# EAGLE design multidip_v1.1 (EAGLE 7.5.0)
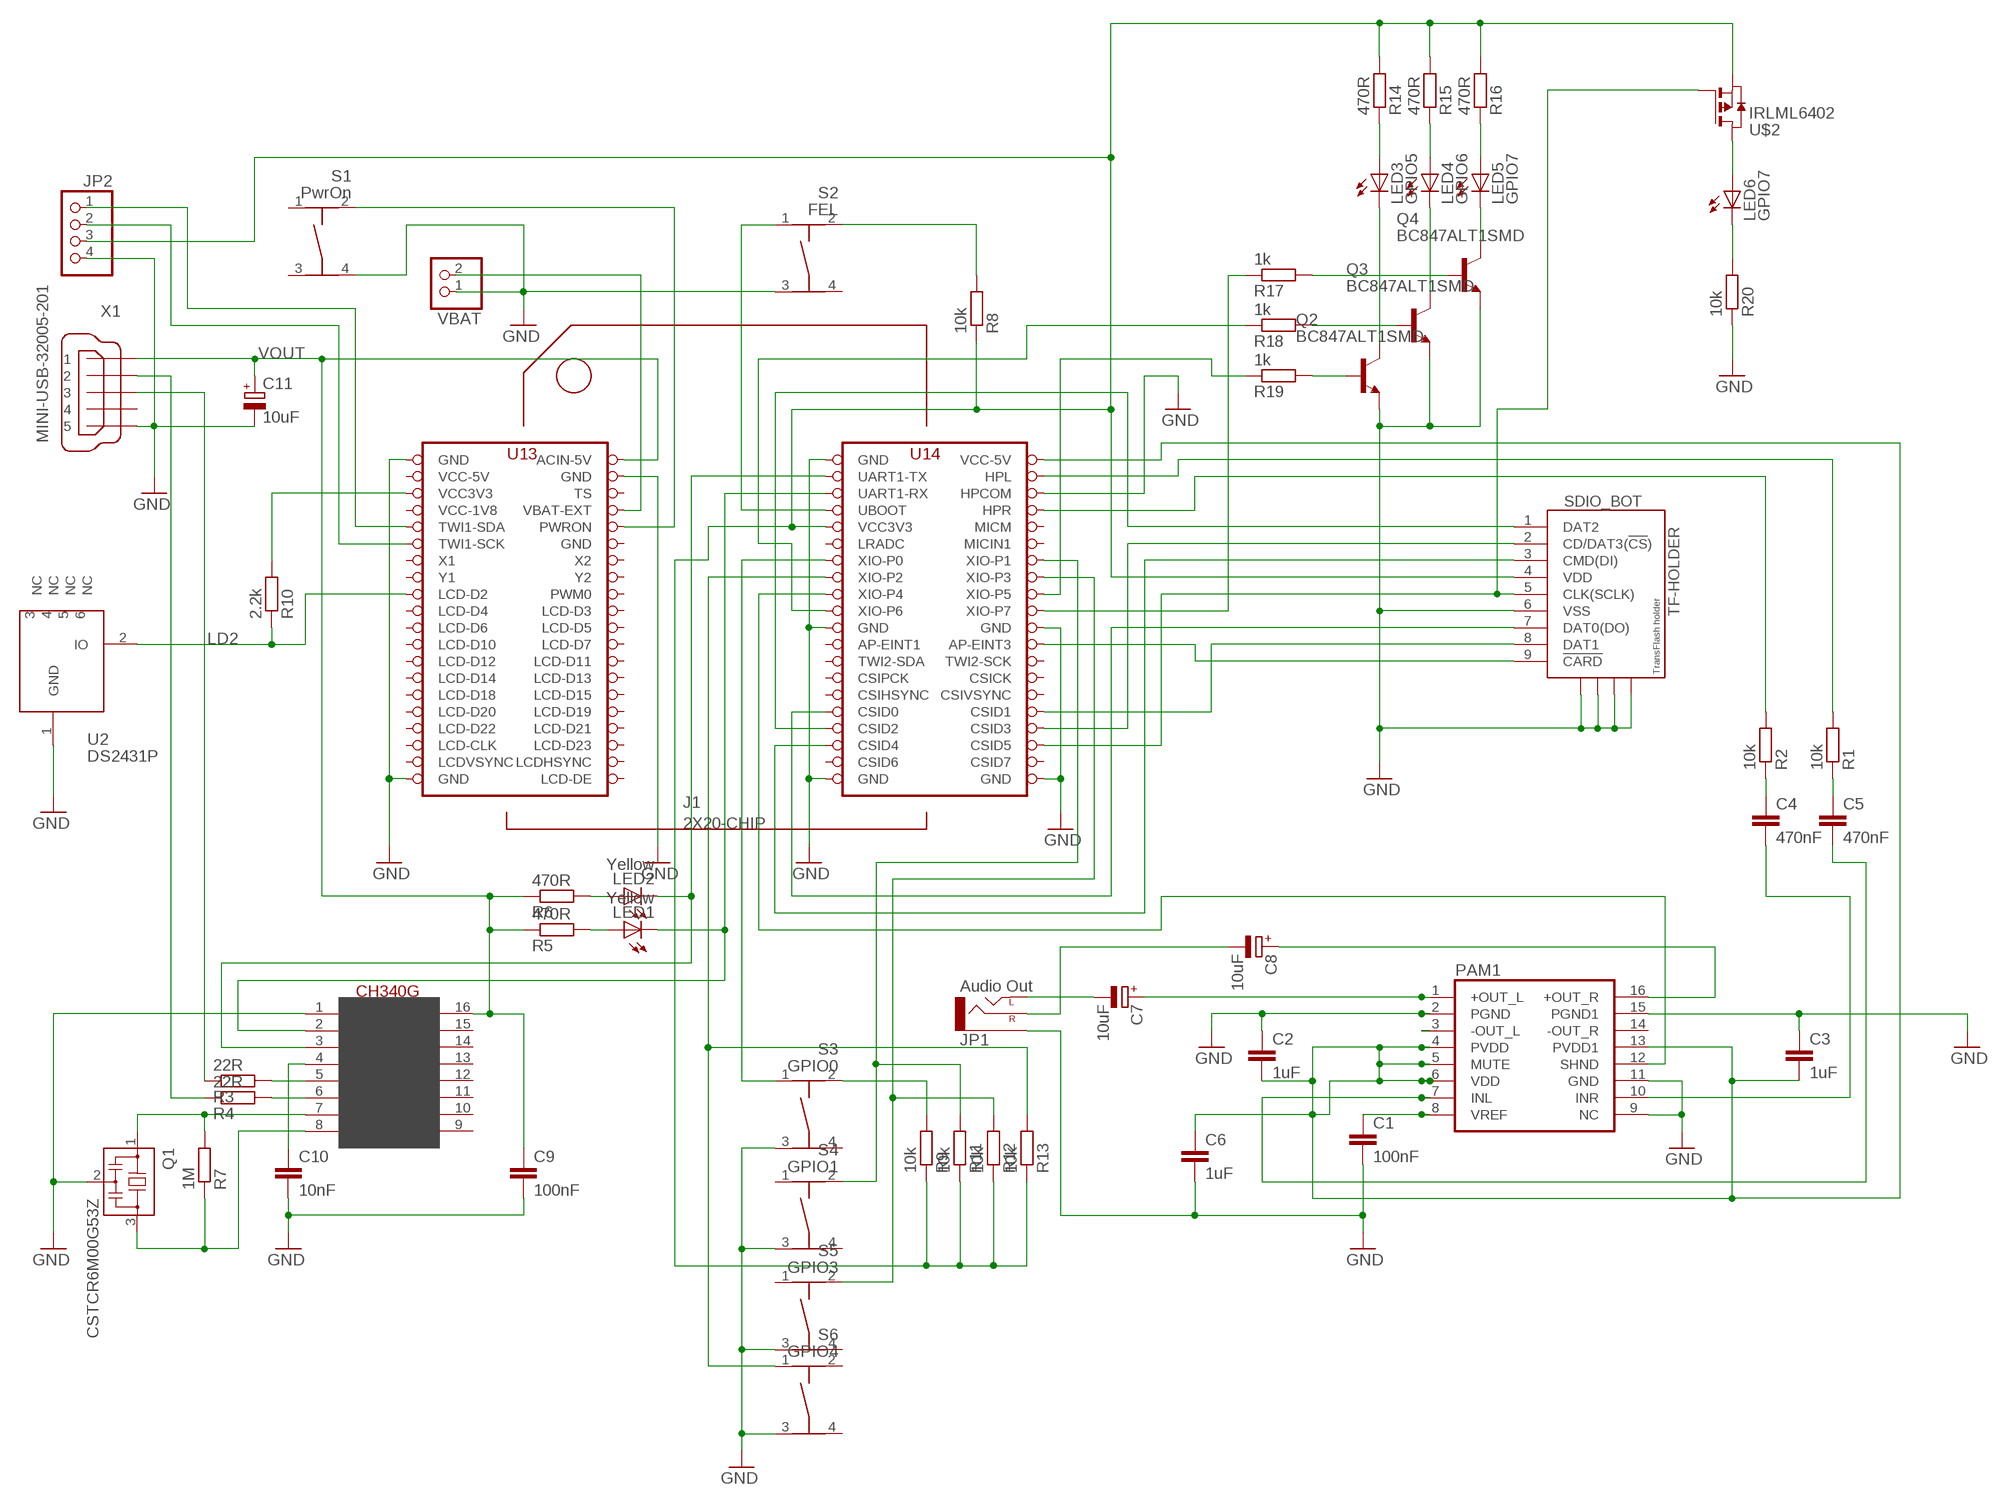
[diagram p0: schematic, sheet 1]

## Parts
C1  100nF  C-EUC0805  [C0805]
C2  1uF  C-EUC0805  [C0805]
C3  1uF  C-EUC0805  [C0805]
C4  470nF  C-EUC0805  [C0805]
C5  470nF  C-EUC0805  [C0805]
C6  1uF  C-EUC0805  [C0805]
C7  10uF  CPOL-EUCT3216  [CT3216]
C8  10uF  CPOL-EUCT3216  [CT3216]
C9  100nF  C-EUC0805  [C0805]
C10  10nF  C-EUC0805  [C0805]
C11  10uF  CPOL-EUCT3216  [CT3216]
J1  2X20-CHIP  [2X20CHIP_OFFSET-TH]
JP1  Audio Out  AUDIO-JACKPTH  [AUDIO-JACK]
JP2  PINHD-1X4  [1X04]
LED1  Yellow  LEDCHIP-LED0805  [CHIP-LED0805]
LED2  Yellow  LEDCHIP-LED0805  [CHIP-LED0805]
LED3  GPIO5  LEDCHIP-LED0805  [CHIP-LED0805]
LED4  GPIO6  LEDCHIP-LED0805  [CHIP-LED0805]
LED5  GPIO7  LEDCHIP-LED0805  [CHIP-LED0805]
LED6  GPIO7  LEDCHIP-LED0805  [CHIP-LED0805]
PAM1  PAM8403  [SOP-16]
Q1  CSTCR6M00G53Z  [CSTCR6M]
Q2  BC847ALT1SMD  [SOT23]
Q3  BC847ALT1SMD  [SOT23]
Q4  BC847ALT1SMD  [SOT23]
R1  10k  R-EU_MELF0204W  [MINI_MELF-0204W]
R2  10k  R-EU_MELF0204W  [MINI_MELF-0204W]
R3  22R  R-EU_MELF0204W  [MINI_MELF-0204W]
R4  22R  R-EU_MELF0204W  [MINI_MELF-0204W]
R5  470R  R-EU_MELF0204W  [MINI_MELF-0204W]
R6  470R  R-EU_MELF0204W  [MINI_MELF-0204W]
R7  1M  R-EU_MELF0204W  [MINI_MELF-0204W]
R8  10k  R-EU_MELF0204W  [MINI_MELF-0204W]
R9  10k  R-EU_MELF0204W  [MINI_MELF-0204W]
R10  2.2k  R-EU_MELF0204W  [MINI_MELF-0204W]
R11  10k  R-EU_MELF0204W  [MINI_MELF-0204W]
R12  10k  R-EU_MELF0204W  [MINI_MELF-0204W]
R13  10k  R-EU_MELF0204W  [MINI_MELF-0204W]
R14  470R  R-EU_MELF0204W  [MINI_MELF-0204W]
R15  470R  R-EU_MELF0204W  [MINI_MELF-0204W]
R16  470R  R-EU_MELF0204W  [MINI_MELF-0204W]
R17  1k  R-EU_MELF0204W  [MINI_MELF-0204W]
R18  1k  R-EU_MELF0204W  [MINI_MELF-0204W]
R19  1k  R-EU_MELF0204W  [MINI_MELF-0204W]
R20  10k  R-EU_MELF0204W  [MINI_MELF-0204W]
S1  PwrOn  TASTER-9314_SMD  [TASTER-9314_SMD]
S2  FEL  TASTER-9314_SMD  [TASTER-9314_SMD]
S3  GPIO0  TASTER-9314_SMD  [TASTER-9314_SMD]
S4  GPIO1  TASTER-9314_SMD  [TASTER-9314_SMD]
S5  GPIO3  TASTER-9314_SMD  [TASTER-9314_SMD]
S6  GPIO4  TASTER-9314_SMD  [TASTER-9314_SMD]
SDIO_BOT  TF-HOLDER  [TF-PULL]
U2  DS2431P  [TSOC6]
U$1  CH340G  [SOIC16]
U$2  IRLML6402  [SOT-23]
VBAT  PINHD-1X2  [1X02]
X1  MINI-USB-32005-201  [32005-201]

## Nets
GND: C1.2 C2.1 C3.1 C6.2 C9.2 C10.2 C11.- J1.GND@1(GND) J1.GND@2(GND) J1.GND@4(GND) J1.GND@5(GND) J1.GND@6(GND) J1.GND@7(GND) J1.GND@8(GND) J1.GND@10(GND) J1.HPCOM JP1.SLEEVE JP2.4 PAM1.2(PGND) PAM1.9(NC) PAM1.11(GND) PAM1.15(PGND1) Q1.2 Q2.2(E) Q3.2(E) Q4.2(E) R20.1 S1.4 S2.3 S3.3 S4.3 S5.3 S6.3 SDIO_BOT.6(VSS) SDIO_BOT.S1 SDIO_BOT.S2 SDIO_BOT.S3 SDIO_BOT.S4 U2.1(GND) U$1.1(GND) VBAT.1 X1.5
LD2: J1.LCD-D2 R10.1 U2.2(IO)
N$1: J1.VCC3V3 R10.2
N$2: J1.CSID3 SDIO_BOT.2(CD/DAT3(!CS!))
N$3: J1.CSID0 SDIO_BOT.7(DAT0(DO))
N$4: J1.CSID4 SDIO_BOT.3(CMD(DI))
N$5: J1.CSID5 SDIO_BOT.5(CLK(SCLK)) U$2.1(G)
N$6: J1.CSID1 SDIO_BOT.8(DAT1)
N$7: C2.2 C3.2 C6.1 J1.VCC5V@1(VCC-5V) PAM1.4(PVDD) PAM1.5(MUTE) PAM1.6(VDD) PAM1.13(PVDD1)
N$8: LED3.C Q2.3(C)
N$9: J1.CSID2 SDIO_BOT.1(DAT2)
N$10: LED4.C Q3.3(C)
N$11: C7.+ PAM1.1(+OUT_L)
N$12: C7.- JP1.TIP(LEFT)
N$13: C8.+ PAM1.16(+OUT_R)
N$14: C8.- JP1.RING(RIGHT)
N$15: R3.1 X1.3
N$16: J1.AP-EINT3 SDIO_BOT.9(!CARD)
N$17: PAM1.3(-OUT_L)
N$18: Q4.1(B) R17.2
N$19: J1.HPL R1.2
N$20: C1.1 PAM1.8(VREF)
N$21: C4.1 R2.1
N$22: C5.1 R1.1
N$23: J1.XIO-P1 R11.2 S4.2
N$24: J1.XIO-P3 R12.2 S5.2
N$25: J1.XIO-P0 S3.1
N$26: J1.XIO-P2 R13.2 S6.1
N$27: J1.XIO-P4 PAM1.12(SHND)
N$28: J1.BAT(VBAT-EXT) VBAT.2
N$29: J1.PWRON S1.2
N$30: J1.HPR R2.2
N$31: C4.2 PAM1.10(INR)
N$32: C5.2 PAM1.7(INL)
N$33: R3.2 U$1.5(D+)
N$34: R4.2 U$1.6(D-)
N$35: Q1.1 R7.2 U$1.7(XI)
N$36: Q1.3 R7.1 U$1.8(XO)
N$37: C10.1 U$1.4(V3)
N$38: J1.UART1-TX LED2.C U$1.3(RX)
N$39: J1.UART1-RX LED1.C U$1.2(TX)
N$40: LED2.A R6.2
N$41: LED1.A R5.2
N$42: J1.FEL(UBOOT) S2.1
N$43: R8.2 S2.2
N$44: LED5.C Q4.3(C)
N$45: R9.2 S3.2
N$46: J1.VCC3V3@1(VCC3V3) JP2.3 R8.1 R9.1 R11.1 R12.1 R13.1 R14.2 R15.2 R16.2 SDIO_BOT.4(VDD) U$2.2(S)
N$47: LED3.A R14.1
N$48: LED4.A R15.1
N$49: LED5.A R16.1
N$50: J1.XIO-P5 R19.1
N$51: J1.XIO-P6 R18.1
N$52: J1.XIO-P7 R17.1
N$53: R4.1 X1.2
N$54: J1.TWI1-SCK JP2.2
N$55: J1.TWI1-SDA JP2.1
N$56: Q3.1(B) R18.2
N$57: Q2.1(B) R19.2
N$58: LED6.A U$2.3(D)
N$59: LED6.C R20.2
VOUT: C9.1 C11.+ J1.CHG-IN(ACIN-5V) R5.1 R6.1 U$1.16(VCC) X1.1
Unconnected: J1.AP-EINT1 J1.CSICK J1.CSID6 J1.CSID7 J1.CSIHSYNC J1.CSIPCK J1.CSIVSYNC J1.LCD-CLK J1.LCD-D3 J1.LCD-D4 J1.LCD-D5 J1.LCD-D6 J1.LCD-D7 J1.LCD-D10 J1.LCD-D11 J1.LCD-D12 J1.LCD-D13 J1.LCD-D14 J1.LCD-D15 J1.LCD-D18 J1.LCD-D19 J1.LCD-D20 J1.LCD-D21 J1.LCD-D22 J1.LCD-D23 J1.LCD-DE J1.LCD-HSYNC(LCDHSYNC) J1.LCD-VSYNC(LCDVSYNC) J1.LRADC J1.MICIN1 J1.MICM J1.PWM0 J1.TS J1.TWI2-SCK J1.TWI2-SDA J1.X1 J1.X2 J1.Y1 J1.Y2 PAM1.14(-OUT_R) S1.1 S1.3 S2.4 S3.4 S4.1 S4.4 S5.1 S5.4 S6.2 S6.4 U2.3(NC) U2.4(NC) U2.5(NC) U2.6(NC) U$1.9(CTS) U$1.10(DSR) U$1.11(RI) U$1.12(DCD) U$1.13(DTR) U$1.14(RTS) U$1.15(RS232) X1.4

## Power pins joined to a net without a drawn wire
GND: J1.GND@3(GND)
VCC-1V8: J1.VCC1V8(VCC-1V8)
VCC-5V: J1.VCC5V@0(VCC-5V)

## Library data of the parts
C1-C6 C9 C10 = rcl:C-EU: CAPACITOR, European symbol
C7 C8 C11 = rcl:CPOL-EU: POLARIZED CAPACITOR, European symbol
J1 = JKW_CHIP:2X20-CHIP: Through hole layout with chip reference
JP1 = SparkFun-Connectors:AUDIO-JACK: 3.5mm Audio Jack Simple 3.5mm common PCB mount audio jack. Variant PTH is our storefront SKU PRT-08032
JP2 = pinhead:PINHD-1X4: PIN HEADER
LED1-LED6 = led:LED: LED OSRAM: - CHIPLED LG R971, LG N971, LY N971, LG Q971, LY Q971, LO R971, LY R971 LH N974, LH R974 LS Q976, LO Q976, LY Q976 LO Q996 - Hyper CHIPLED LW Q18S LB Q993, LB Q99A, LB R99A - SideLED LS A670, LO A670, LY A670, LG A670, LP A670 LB A673, LV A673, LT A673, LW A673 LH A674 LY A675 LS A676, LA A676, LO A676, LY A676, LW A676 LS A679, LY A679, LG A679 - Hyper Micro SIDELED® LS Y876, LA Y876, LO Y876, LY Y876 LT Y87S - SmartLED LW L88C, LW L88S LB L89C, LB L89S, LG L890 LS L89K, LO L89K, LY L89K LS L896, LA L896, LO L896, LY L896 - TOPLED LS T670, LO T670, LY T670, LG T670, LP T670 LSG T670, LSP T670, LSY T670, LOP T670, LYG T670 LG T671, LOG T671, LSG T671 LB T673, LV T673, LT T673, LW T673 LH T674 LS T676, LA T676, LO T676, LY T676, LB T676, LH T676, LSB T676, LW T676 LB T67C, LV T67C, LT T67C, LS T67K, LO T67K, LY T67K, LW E67C LS E67B, LA E67B, LO E67B, LY E67B, LB E67C, LV E67C, LT E67C LW T67C LS T679, LY T679, LG T679 LS T770, LO T770, LY T770, LG T770, LP T770 LB T773, LV T773, LT T773, LW T773 LH T774 LS E675, LA E675, LY E675, LS T675 LS T776, LA T776, LO T776, LY T776, LB T776 LHGB T686 LT T68C, LB T68C - Hyper Mini TOPLED® LB M676 - Mini TOPLED Santana® LG M470 LS M47K, LO M47K, LY M47K Source: http://www.osram.convergy.de LUXEON: - LUMILED® LXK2-PW12-R00, LXK2-PW12-S00, LXK2-PW14-U00, LXK2-PW14-V00 LXK2-PM12-R00, LXK2-PM12-S00, LXK2-PM14-U00 LXK2-PE12-Q00, LXK2-PE12-R00, LXK2-PE12-S00, LXK2-PE14-T00, LXK2-PE14-U00 LXK2-PB12-K00, LXK2-PB12-L00, LXK2-PB12-M00, LXK2-PB14-N00, LXK2-PB14-P00, LXK2-PB14-Q00 LXK2-PR12-L00, LXK2-PR12-M00, LXK2-PR14-Q00, LXK2-PR14-R00 LXK2-PD12-Q00, LXK2-PD12-R00, LXK2-PD12-S00 LXK2-PH12-R00, LXK2-PH12-S00 LXK2-PL12-P00, LXK2-PL12-Q00, LXK2-PL12-R00 Source: www.luxeon.com KINGBRIGHT: KA-3528ASYC Source: www.kingbright.com
PAM1 = JKW_CHIP:PAM8403: Dual channel audio amplifier IC - PAM8403
Q1 = murata-filter:CSTCR: Resonator Source: murata.co.jp; MPN: CSTCR6M00G53-R0; OC_FARNELL: 1170434; OC_NEWARK: 25M8759
Q2-Q4 = transistor-npn:BC847*: NPN Transistor
R1-R20 = rcl:R-EU_: RESISTOR, European symbol
S1-S6 = Ergaenzung:TASTER-9314_SMD
SDIO_BOT = JKW_CHIP:TF-HOLDER: TF / Micro SD socket is PUSH-PUSH type, the card can be pushed into and auto locked and pushed out by simply press the card. Surface Mounting type.
U2 = JKW_CHIP:DS2431: 1024-Bit EEPROM This chip provides a 4x256 Bit EEPROM, which can be programmed@5V. Write protection and OTP emulation are available, too. Author: Jan Kandziora <jjj@gmx.de>; DESCRIPTION: IC, 1024-Bit, 1-Wire EEPROM, TSOC6; FOOTPRINT: TSOC6; LINK: http://www.digikey.com/product-detail/en/DS2431P%2BT%26R/DS2431P%2BT%26RCT-ND/3647900; MFG: DIGIKEY; MFG_PN: DS2431P+T&RCT-ND; PART_TYPE: IC; PRICE: 0.98; VENDOR: MAXIM; VENDOR_PART_NUMBER: DS2431P+T&R
U$1 = usb-serial:CH340G
U$2 = IRLML6402:IRLML6402
VBAT = pinhead:PINHD-1X2: PIN HEADER
X1 = con-cypressindustries:MINI-USB-: MINI USB-B Conector Source: www.cypressindustries.com; OC_FARNELL: unknown; OC_NEWARK: unknown

## Board
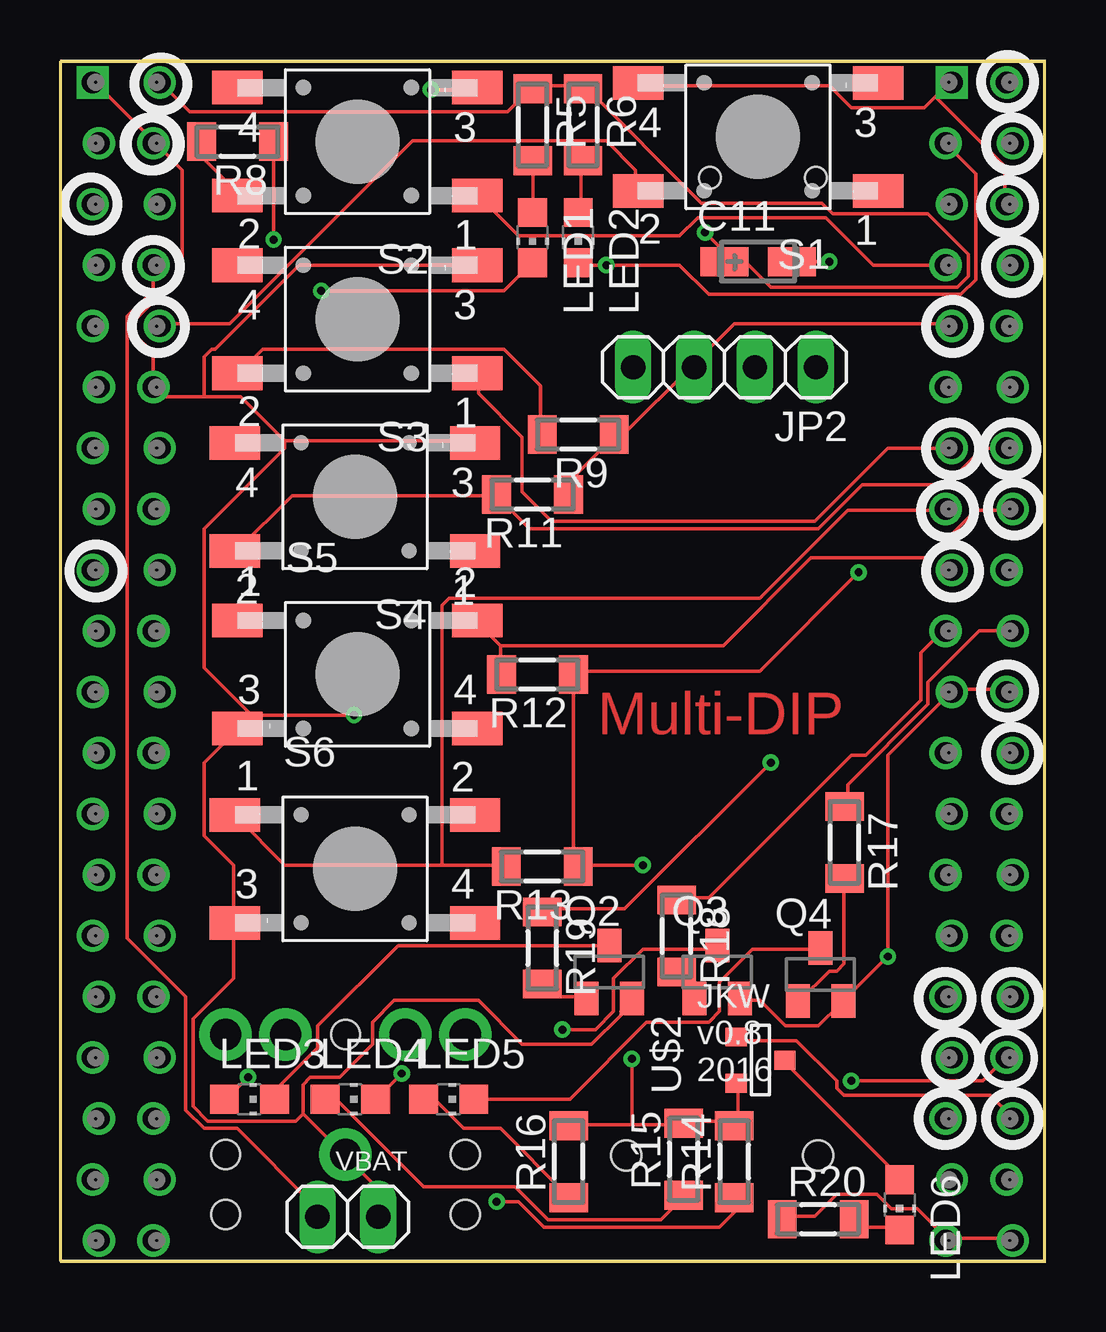
[diagram p1: board, top side]
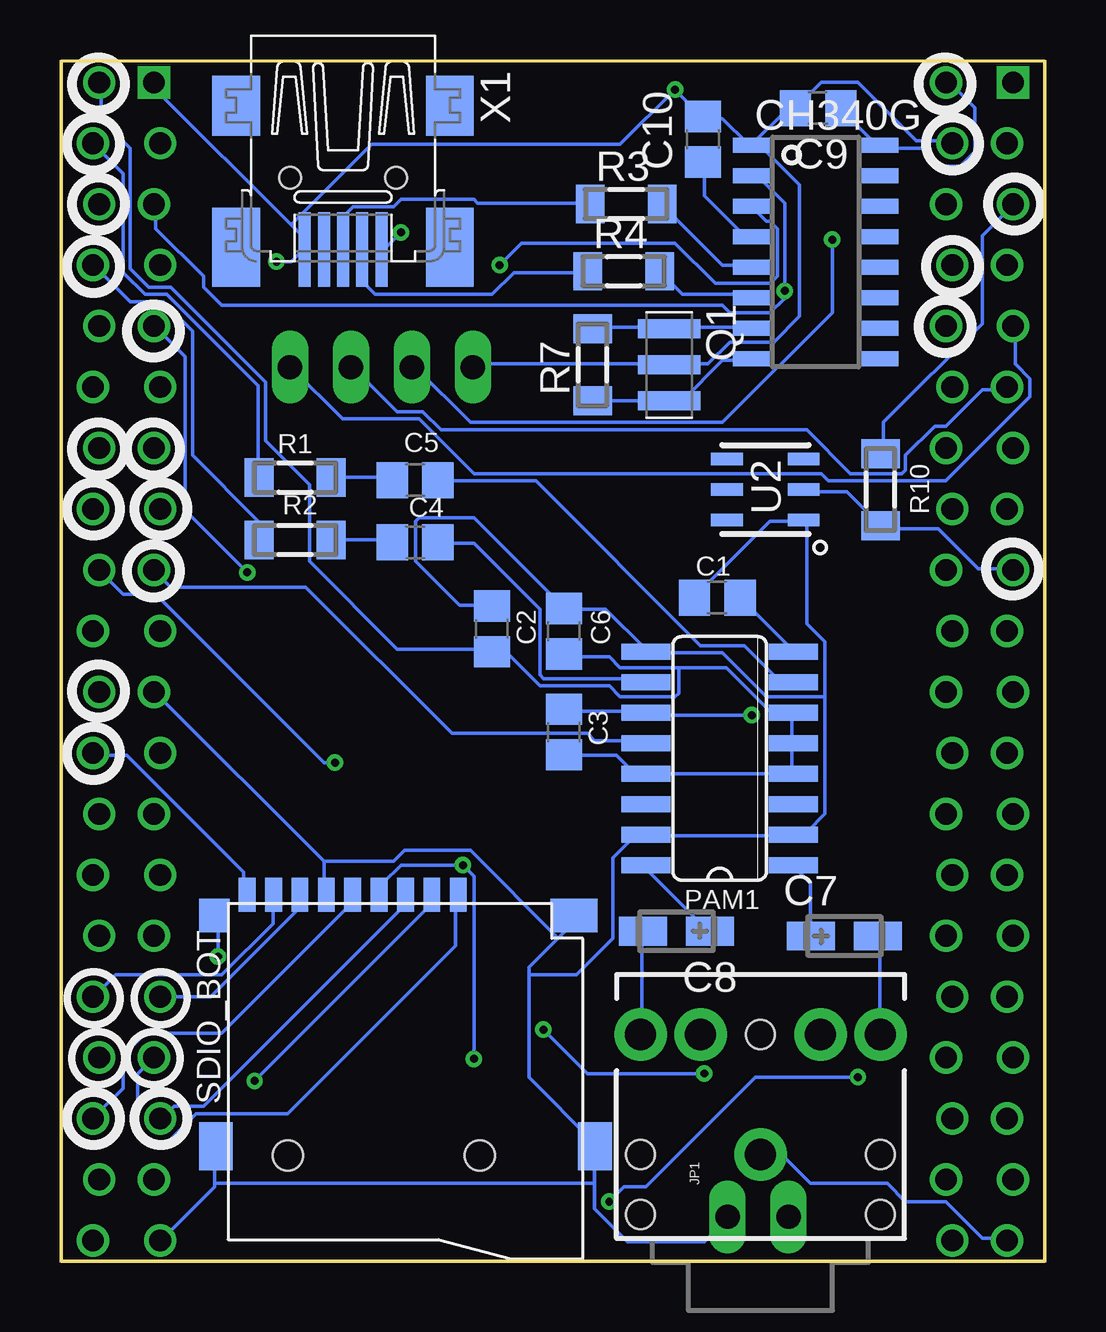
[diagram p2: board, bottom side, seen from below]

Size 41.1 x 50.1 mm. Coordinates in mm from the lower left corner, seen from the top.
Outline: 0,0.1 41,0.1 41,2
Outline: 0,0 41.1,0 41.1,50.1 0,50.1 0,0
Copper layers (1*16): Top 0.0356mm / dielectric 1.5011mm / Bottom 0.0356mm
Design rules "oshpark": minimum track width 6mil, minimum drill 13mil, track to track 6mil, track to pad 6mil, pad to pad 6mil, via to via 6mil, smd to smd 6mil, copper to edge 15mil, drill to drill 6mil, minimum pad ring 7mil, minimum via ring 7mil, stop-mask expansion 3mil, vias tented up to drill 0mil, thermal gap 10mil

### Footprints (pad centres in the part's own frame; a part is rotated, then mirrored left to right if it is on the bottom)
C0805 = smd 1.3 x 1.5: 1 -0.95,0; 2 0.95,0
CT3216 = smd 2 x 1.2: + -1.4,0; - 1.4,0
2X20CHIP_OFFSET-TH = drill 0.9: AP-EINT1 15.113,-3.81; AP-EINT3 17.907,-3.81; BAT -17.907,16.51; CHG-IN -17.653,24.13; CSICK 17.907,-8.89; CSID0 15.113,-13.97; CSID1 17.907,-13.97; CSID2 15.367,-16.51; CSID3 17.653,-16.51; CSID4 15.113,-19.05; CSID5 17.907,-19.05; CSID6 15.367,-21.59; CSID7 17.653,-21.59; CSIHSYNC 15.367,-11.43; CSIPCK 15.113,-8.89; CSIVSYNC 17.653,-11.43; FEL 15.113,16.51; GND@1 -17.907,11.43; GND@2 -20.193,-24.13; GND@4 17.653,-1.27; GND@5 17.907,-24.13; GND@6 15.113,-24.13; GND@7 15.367,-1.27; GND@10 -17.907,21.59; HPCOM 17.653,19.05; HPL 17.907,21.59; HPR 17.907,16.51; LCD-CLK -20.193,-19.05; LCD-D2 -20.447,3.81; LCD-D3 -17.907,1.27; LCD-D4 -20.193,1.27; LCD-D5 -17.653,-1.27; LCD-D6 -20.447,-1.27; LCD-D7 -17.907,-3.81; LCD-D10 -20.193,-3.81; LCD-D11 -17.653,-6.35; LCD-D12 -20.447,-6.35; LCD-D13 -17.907,-8.89; LCD-D14 -20.193,-8.89; LCD-D15 -17.653,-11.43; LCD-D18 -20.447,-11.43; LCD-D19 -17.907,-13.97; LCD-D20 -20.193,-13.97; LCD-D21 -17.653,-16.51; LCD-D22 -20.447,-16.51; LCD-D23 -17.907,-19.05; LCD-DE -17.907,-24.13; LCD-HSYNC -17.653,-21.59; LCD-VSYNC -20.447,-21.59; LRADC 15.113,11.43; MICIN1 17.907,11.43; MICM 17.653,13.97; PWM0 -17.653,3.81; PWRON -17.653,13.97; TS -17.653,19.05; TWI1-SCK -20.193,11.43; TWI1-SDA -20.447,13.97; TWI2-SCK 17.653,-6.35; TWI2-SDA 15.367,-6.35; UART1-RX 15.367,19.05; UART1-TX 15.113,21.59; VCC1V8 -20.193,16.51; VCC3V3 -20.447,19.05; VCC3V3@1 15.367,13.97; VCC5V@0 -20.193,21.59; VCC5V@1 17.653,24.13; X1 -20.447,8.89; X2 -17.653,8.89; XIO-P0 15.367,8.89; XIO-P1 17.653,8.89; XIO-P2 15.113,6.35; XIO-P3 17.907,6.35; XIO-P4 15.367,3.81; XIO-P5 17.653,3.81; XIO-P6 15.113,1.27; XIO-P7 17.907,1.27; Y1 -20.193,6.35; Y2 -17.907,6.35 | drill 0.9 square: GND@3 -20.447,24.13; GND@8 15.367,24.13
AUDIO-JACK = drill 1.3 pad 2.184: RING 5,5; RSH 5,2.5; SLEEVE 0,0; TIP 5,-5; TSH 5,-2.5 | hole 1.2: 0,5; -2.5,5; -2.5,-5; 0,-5; 5,0
1X04 = drill 1.016 long: 1 -3.81,0; 2 -1.27,0; 3 1.27,0; 4 3.81,0
CHIP-LED0805 = smd 1.2 x 1.2: A 0,-1.05; C 0,1.05
SOP-16 = smd 0.66 x 2.032: 1 -4.445,-3.073; 2 -3.175,-3.073; 3 -1.905,-3.073; 4 -0.635,-3.073; 5 0.635,-3.073; 6 1.905,-3.073; 7 3.175,-3.073; 8 4.445,-3.073; 9 4.445,3.073; 10 3.175,3.073; 11 1.905,3.073; 12 0.635,3.073; 13 -0.635,3.073; 14 -1.905,3.073; 15 -3.175,3.073; 16 -4.445,3.073
CSTCR6M = smd 0.8 x 2.6: 1 -1.5,0; 2 0,0; 3 1.5,0
SOT23 = smd 1 x 1.4: 1 -0.95,-1.1; 2 0.95,-1.1; 3 0,1.1
MINI_MELF-0204W = smd 1.2 x 1.6: 1 -1.5,0; 2 1.5,0
TASTER-9314_SMD = smd 2.1 x 1.4: 1 -5,2.25; 2 5,2.25; 3 -5,-2.25; 4 5,-2.25
TF-PULL = smd 0.7 x 1.4: 1 -2.2,-7.62; 2 -1.1,-7.62; 3 0,-7.62; 4 1.1,-7.62; 5 2.2,-7.62; 6 3.3,-7.62; 7 4.4,-7.62; 8 5.5,-7.62; 9 6.6,-7.62 | smd 1.4 x 2: S1 -7.9,2.85; S2 7.9,2.85 | smd 1.28 x 1.4: S3 7.96,-6.75 | smd 1.95 x 1.4: S4 -7.025,-6.75 | hole 1.25: -3.1,3.25; 4.9,3.25
TSOC6 = smd 0.53 x 1.33: 1 -1.27,-1.6; 2 0,-1.6; 3 1.27,-1.6; 4 1.27,1.6; 5 0,1.6; 6 -1.27,1.6
SOIC16 = smd 0.635 x 1.524: 1 -4.445,-2.695; 2 -3.175,-2.695; 3 -1.905,-2.695; 4 -0.635,-2.695; 5 0.635,-2.695; 6 1.905,-2.695; 7 3.175,-2.695; 8 4.445,-2.695; 9 4.445,2.695; 10 3.175,2.695; 11 1.905,2.695; 12 0.635,2.695; 13 -0.635,2.695; 14 -1.905,2.695; 15 -3.175,2.695; 16 -4.445,2.695
SOT-23 = smd 0.787 x 0.889: 1 0.991,1.016; 2 -0.94,1.016; 3 0.025,-1.016
1X02 = drill 1.016 long: 1 -1.27,0; 2 1.27,0
32005-201 = smd 3.1 x 0.5: 1 3,1.6; 2 3,0.8; 3 3,0; 4 3,-0.8; 5 3,-1.6 | smd 2.5 x 2: M1 -3,-4.45; M2 -3,4.45 | smd 3.3 x 2: M3 2.9,4.45; M4 2.9,-4.45 | hole 0.9: 0,2.2; 0,-2.2

### Placement (x,y rotation side)
C1  13.7,27.7 180 bottom
C2  23.1,26.4 270 bottom
C3  20.1,22.1 270 bottom
C4  26.3,30 0 bottom
C5  26.3,32.6 0 bottom
C6  20.1,26.3 90 bottom
C7  8.4,13.6 0 bottom
C8  15.4,13.8 180 bottom
C9  9.5,48.1 180 bottom
C10  14.3,46.8 90 bottom
C11  29.1,41.7 0 top
J1  21.81,25.04 0 top
JP1  11.9,4.5 90 bottom
JP2  27.7,37.3 180 top
LED1  19.7,42.7 180 top
LED2  21.6,42.7 180 top
LED3  7.9,6.8 270 top
LED4  12.1,6.8 270 top
LED5  16.2,6.8 270 top
LED6  35,2.4 180 top
PAM1  13.6,21 90 bottom
Q1  15.7,37.4 270 bottom
Q2  22.9,12.1 0 top
Q3  27.4,12.1 0 top
Q4  31.7,12 0 top
R1  31.3,32.7 180 bottom
R2  31.3,30.1 180 bottom
R3  17.5,44.1 0 bottom
R4  17.6,41.3 0 bottom
R5  19.7,47.4 270 top
R6  21.8,47.4 270 top
R7  18.9,37.4 90 bottom
R8  7.4,46.7 180 top
R9  21.6,34.5 180 top
R10  6.9,32.2 90 bottom
R11  19.7,32 180 top
R12  19.9,24.5 180 top
R13  20.1,16.5 180 top
R14  28.1,4.2 90 top
R15  26,4.3 90 top
R16  21.2,4.2 90 top
R17  32.7,17.5 270 top
R18  25.7,13.6 270 top
R19  20.1,13.1 270 top
R20  31.6,1.8 0 top
S1  29.1,46.9 180 top
S2  12.4,46.7 180 top
S3  12.4,39.3 180 top
S4  12.3,31.9 180 top
S5  12.4,24.5 0 top
S6  12.3,16.4 0 top
SDIO_BOT  26.7,7.7 180 bottom
U2  11.7,32.2 90 bottom
U$1  9.6,42.1 270 bottom
U$2  29.2,8.4 90 top
VBAT  12,1.9 180 top
X1  29.3,45.2 270 bottom

### Tracks (layer width: path | path; a pad name or v marks a point on that pad's centre or on a via)
GND  (via drill 0.33)
  Top 0.152: v32.07,41.7 30.55,41.7 C11.- | 36.49,48.56 37.1,49.17 J1.GND@8 | 36.49,48.56 36.03,48.1 32.99,48.1 32.07,49.02 24.15,49.02 S1.4 | 36.49,48.56 39.39,45.66 39.39,44.14 J1.HPCOM | 9.36,34.23 17.29,34.23 S4.3 | 9.36,34.23 7.54,36.06 6.01,36.06 | 6.01,36.06 4.33,36.06 4.03,36.37 J1.GND@1 3.88,36.52 3.88,37.89 3.12,38.65 3.12,39.26 5.1,41.24 5.1,45.51 4.03,46.58 J1.GND@10 3.88,46.73 1.44,49.17 J1.GND@3 | S3.3 9.97,41.55 6.47,38.05 6.32,38.05 6.01,37.74 6.01,36.06 | v15.46,48.87 17.29,48.87 S2.3 | S5.3 7.38,22.2 6.01,20.82 6.01,17.78 7.23,16.56 7.23,14.27 S6.3 7.23,14.12 7.23,11.83 5.55,10.16 5.55,6.5 6.16,5.89 9.82,5.89 10.13,6.19 | 7.99,22.8 v12.26,22.8 | 7.99,22.8 7.54,22.35 S5.3 | J1.GND@4 39.39,23.87 37.25,23.87 J1.GND@7 37.1,23.72 34.51,21.13 v34.51,12.75 32.68,10.92 Q4.2 32.53,10.76 31.61,9.85 30.24,9.85 29.18,10.92 28.41,10.92 Q3.2 | 10.13,6.19 10.13,7.41 10.43,7.72 11.65,7.72 13.02,9.09 13.02,10 13.94,10.92 17.44,10.92 19.27,9.09 22.17,9.09 23.38,10.31 23.38,10.46 23.84,10.92 Q2.2 | 10.13,6.19 11.8,4.52 JP1.SLEEVE 11.96,4.36 13.17,3.15 13.17,1.93 VBAT.1 | 9.36,34.23 9.36,33.93 6.01,30.58 6.01,24.79 7.99,22.8 | 7.99,22.8 S5.3 | 36.95,1.01 35.73,2.23 34.66,2.23 34.05,2.84 32.38,2.84 31.46,1.93 30.24,1.93 R20.1 | 36.95,1.01 39.69,1.01 J1.GND@5 | 36.95,1.01 J1.GND@6
  Bottom 0.152: v32.07,41.7 31.46,41.7 31.01,42.16 X1.5 31.01,42.31 31.01,42.77 31.46,43.23 | 31.46,43.23 37.1,48.87 37.1,49.17 J1.GND@8 | JP2.4 23.84,37.43 15.76,37.43 Q1.2 15.61,37.43 14.09,37.43 13.17,38.35 11.35,38.35 10.28,39.42 10.28,44.9 12.11,46.73 | 12.11,46.73 12.26,46.58 U$1.1 | 12.11,46.73 10.89,47.95 10.58,47.95 C9.2 10.43,48.1 9.36,49.17 7.84,49.17 5.4,46.73 4.03,46.73 J1.GND@10 | U$1.1 12.41,46.58 13.48,47.65 14.24,47.65 C10.2 14.39,47.8 v15.46,48.87 17.75,46.58 28.11,46.58 31.46,43.23 | 12.11,46.73 U$1.1 | C2.1 23.23,27.38 24.45,27.38 26.28,29.21 26.28,30.88 26.13,31.03 23.84,31.03 20.18,27.38 C6.2 20.03,27.22 18.36,27.22 16.68,25.55 PAM1.9 16.53,25.4 13.48,25.4 11.65,23.57 9.21,23.57 | C1.2 14.55,27.83 11.5,30.88 10.13,30.88 U2.1 9.97,30.88 9.97,26.62 9.21,25.85 9.21,23.57 | 9.21,23.57 9.21,18.69 9.97,17.93 10.43,17.93 PAM1.2 10.58,17.78 16.53,17.78 PAM1.15 16.68,17.78 17.14,17.78 18.05,16.86 18.05,13.51 19.58,11.98 21.56,11.98 | v34.51,12.75 34.51,14.42 SDIO_BOT.S3 | C3.1 20.03,22.96 16.68,22.96 PAM1.11 16.53,22.8 v12.26,22.8 | 30.09,16.71 30.09,15.34 SDIO_BOT.6 | 30.09,16.71 37.1,23.72 J1.GND@7 | 20.34,13.51 21.56,12.29 21.56,11.98 | 20.34,13.51 19.73,14.12 19.73,14.42 SDIO_BOT.S4 | 21.56,11.98 21.56,7.72 18.81,4.97 SDIO_BOT.S1 18.81,4.82 18.81,3.3 | J1.GND@2 1.74,1.01 2.66,1.01 4.18,2.54 5.86,2.54 6.62,3.3 9.82,3.3 10.89,4.36 11.8,4.36 JP1.SLEEVE | 18.81,3.3 18.81,2.23 17.44,0.86 14.24,0.86 13.33,1.77 VBAT.1 | 30.09,16.71 27.2,16.71 26.74,17.17 23.99,17.17 20.34,13.51 | 34.66,3.3 34.66,3.15 36.8,1.01 J1.GND@6 | 34.66,3.3 34.66,4.82 SDIO_BOT.S2
  Bottom 0.152: 34.66,3.3 18.81,3.3
LD2
  Bottom 0.152: U2.2 9.97,32.1 8.3,32.1 6.93,30.73 R10.1 6.77,30.58 4.49,30.58 2.81,28.9 1.44,28.9 J1.LCD-D2
N$1
  Bottom 0.152: R10.2 6.77,33.78 6.77,35 2.66,39.11 2.66,42.77 1.44,43.99 J1.VCC3V3
N$2  (via drill 0.33)
  Top 0.152: v32.99,7.56 38.47,7.56 39.39,8.48 J1.CSID3
  Bottom 0.152: v32.99,7.56 25.67,14.88 25.67,15.19 SDIO_BOT.2
N$3
  Bottom 0.152: J1.CSID0 34.82,11.07 31.16,14.73 31.16,15.19 SDIO_BOT.7
N$4
  Bottom 0.152: SDIO_BOT.3 26.74,15.19 26.74,14.88 35.12,6.5 36.34,6.5 36.8,6.04 J1.CSID4
N$5
  Top 0.152: U$2.1 28.26,9.24 30.7,9.24 32.38,7.56 32.38,7.26 32.68,6.96 38.78,6.96 39.69,6.04 J1.CSID5
  Bottom 0.152: SDIO_BOT.5 29.02,15.19 29.02,14.88 34.36,9.55 37.56,9.55 38.47,8.63 38.47,7.26 39.69,6.04 J1.CSID5
N$6
  Bottom 0.152: SDIO_BOT.8 32.22,15.19 32.22,14.12 34.36,11.98 38.78,11.98 39.69,11.07 J1.CSID1
N$7
  Bottom 0.152: C3.2 20.03,21.13 17.9,21.13 17.14,20.37 PAM1.13 16.53,20.37 10.58,20.37 | 10.58,20.37 10.58,21.59 PAM1.5 10.58,21.74 10.58,22.8 PAM1.6 10.58,22.96 11.5,22.96 13.33,24.79 15.31,24.79 | 15.31,24.79 17.75,24.79 18.2,25.24 20.03,25.24 C6.1 | 15.31,24.79 15.31,23.72 15.46,23.57 17.75,23.57 18.2,24.02 21.1,24.02 22.47,25.4 23.08,25.4 C2.2 23.23,25.55 27.04,25.55 30.7,29.21 30.7,32.41 32.53,34.23 32.53,36.67 36.49,40.64 37.41,40.64 38.17,41.4 38.17,46.43 39.39,47.65 39.39,49.17 J1.VCC5V@1 | 10.58,20.37 PAM1.4
N$8
  Top 0.152: LED3.C 9.06,6.8 9.06,7.26 10.74,8.94 10.74,9.85 14.09,13.2 22.77,13.2 Q2.3
N$9
  Bottom 0.152: SDIO_BOT.1 24.6,15.19 24.6,13.2 31.61,6.19 35.42,6.19 36.64,4.97 37.25,4.97 37.86,5.58 37.86,7.87 37.25,8.48 J1.CSID2
N$10  (via drill 0.33)
  Top 0.152: v14.24,7.87 13.17,6.8 LED4.C | v20.95,9.7 22.32,9.7 23.08,10.46 23.08,11.83 24.3,13.05 27.35,13.05 Q3.3
  Bottom 0.152: v14.24,7.87 19.12,7.87 v20.95,9.7
N$11
  Bottom 0.152: C7.+ 9.82,13.66 9.82,15.79 10.43,16.4 PAM1.1
N$12
  Bottom 0.152: C7.- 6.93,13.51 6.93,9.55 JP1.TIP
N$13
  Bottom 0.152: C8.+ 14.09,13.81 16.68,16.4 PAM1.16
N$14
  Bottom 0.152: C8.- 16.83,13.66 16.83,9.55 JP1.RING
N$15
  Bottom 0.152: R3.1 19.12,44.14 23.69,44.14 23.84,44.29 26.89,44.29 27.2,43.99 28.87,43.99 29.18,43.68 29.18,42.31 X1.3
N$16
  Bottom 0.152: SDIO_BOT.9 33.44,15.34 33.44,16.25 38.32,21.13 39.69,21.13 J1.AP-EINT3
N$18
  Top 0.152: Q4.1 30.85,10.92 32.07,12.14 32.38,12.14 32.68,12.44 32.68,15.95 R17.2
N$19
  Bottom 0.152: R1.2 32.83,32.71 32.83,36.52 36.64,40.33 37.56,40.33 38.47,41.24 38.47,45.36 39.69,46.58 J1.HPL
N$20
  Bottom 0.152: C1.1 12.72,27.68 10.58,25.55 PAM1.8
N$21
  Bottom 0.152: C4.1 27.35,30.12 29.79,30.12 R2.1
N$22
  Bottom 0.152: C5.1 27.35,32.71 29.79,32.71 R1.1
N$23
  Top 0.152: S4.2 7.38,29.66 9.67,31.95 18.05,31.95 R11.2 18.2,31.95 19.58,30.58 31.61,30.58 33.44,32.41 36.95,32.41 38.47,33.93 J1.XIO-P1
N$24
  Top 0.152: 18.36,25.7 18.36,24.63 R12.2 | 18.36,25.7 17.44,26.62 S5.2 | 18.36,25.7 27.65,25.7 31.31,29.36 36.19,29.36 38.17,31.34 39.69,31.34 J1.XIO-P3
N$25
  Top 0.152: J1.XIO-P0 34.51,33.93 31.46,30.88 20.49,30.88 19.27,32.1 19.27,34.39 17.44,36.22 17.44,36.98 S3.1
N$26
  Top 0.152: 15.92,16.56 9.36,16.56 7.38,18.54 S6.1 | 15.92,16.56 18.51,16.56 R13.2 | 15.92,16.56 15.92,27.38 16.22,27.68 29.18,27.68 32.83,31.34 36.8,31.34 J1.XIO-P2
N$27
  Bottom 0.152: PAM1.12 16.68,21.74 18.81,21.74 19.12,22.04 24.76,22.04 30.85,28.14 36.49,28.14 37.1,28.75 J1.XIO-P4
N$28
  Top 0.152: J1.BAT 3.88,41.55 3.88,40.48 2.81,39.42 2.81,13.51 5.25,11.07 5.25,6.35 6.01,5.58 7.38,5.58 10.58,2.38 10.58,1.93 VBAT.2
N$29
  Top 0.152: S1.2 23.99,44.75 23.99,45.51 22.77,46.73 14.7,46.73 7.08,39.11 4.18,39.11 J1.PWRON
N$30
  Bottom 0.152: R2.2 32.83,30.12 32.83,30.88 35.58,33.62 35.58,38.81 36.8,40.03 38.17,40.03 39.69,41.55 J1.HPR
N$31
  Bottom 0.152: C4.2 25.21,29.97 23.84,29.97 21.1,27.22 21.1,24.48 20.95,24.33 16.83,24.33 PAM1.10
N$32
  Bottom 0.152: C5.2 25.21,32.56 21.25,32.56 14.39,25.7 12.56,25.7 11.04,24.18 10.58,24.18 PAM1.7
N$33
  Bottom 0.152: U$1.5 12.41,41.55 13.48,41.55 15.92,43.99 R3.2
N$34
  Bottom 0.152: U$1.6 12.41,40.33 15.15,40.33 16.07,41.24 R4.2
N$35
  Bottom 0.152: U$1.7 12.41,38.96 15.61,38.96 Q1.1 15.76,38.96 18.81,38.96 R7.2
N$36
  Bottom 0.152: U$1.8 12.41,37.59 13.48,37.59 15.15,35.91 15.61,35.91 Q1.3 15.76,35.91 18.81,35.91 R7.1
N$37
  Bottom 0.152: C10.1 14.24,45.82 14.24,44.45 12.41,42.62 U$1.4
N$38  (via drill 0.33)
  Top 0.152: LED2.C 21.71,41.55 v22.77,41.55 25.82,41.55 27.04,40.33 37.56,40.33 38.17,40.94 38.17,45.36 36.95,46.58 J1.UART1-TX
  Bottom 0.152: v22.77,41.55 21.86,42.46 15.46,42.46 13.78,40.79 11.5,40.79 11.19,41.09 11.19,43.07 11.5,43.38 11.65,43.38 12.26,43.99 U$1.3
N$39  (via drill 0.33)
  Top 0.152: v10.89,40.48 18.51,40.48 19.58,41.55 LED1.C
  Bottom 0.152: U$1.2 12.26,45.21 11.96,45.21 10.89,44.14 v10.89,40.48 10.89,40.18 11.5,39.57 13.17,39.57 13.48,39.87 34.36,39.87 35.12,40.64 35.12,41.09 37.1,43.07 37.1,43.99 J1.UART1-RX
N$40
  Top 0.152: LED2.A 21.71,43.84 21.71,45.82 R6.2
N$41
  Top 0.152: LED1.A 19.73,43.84 19.73,45.82 R5.2
N$42
  Top 0.152: J1.FEL 33.9,41.55 31.92,43.53 26.59,43.53 25.82,42.77 19.12,42.77 17.44,44.45 S2.1
N$43
  Top 0.152: R8.2 6.01,46.58 6.01,45.97 7.38,44.6 S2.2
N$44
  Top 0.152: LED5.C 17.29,6.8 21.25,6.8 24.45,10 27.04,10 27.5,10.46 27.5,11.68 28.87,13.05 31.61,13.05 Q4.3
N$45
  Top 0.152: R9.2 20.03,34.54 20.03,36.52 18.51,38.05 8.45,38.05 7.54,37.13 S3.2
N$46  (via drill 0.33)
  Top 0.152: 23.84,5.74 25.98,5.74 R15.2 26.13,5.89 28.26,5.89 | 23.84,5.74 21.25,5.74 R16.2 | 28.26,5.89 28.72,5.89 R14.2 28.26,5.89 | v24.3,16.56 21.71,16.56 R13.1 21.56,16.56 21.4,16.71 21.4,24.48 R12.1 21.4,24.63 29.18,24.63 v33.29,28.75 | v23.84,8.48 23.84,5.74 | R11.1 21.25,32.1 21.25,32.56 23.08,34.39 R9.1 23.23,34.54 23.54,34.54 26.28,37.28 JP2.3 26.43,37.43 28.11,39.11 37.1,39.11 J1.VCC3V3@1 | v8.91,42.62 8.91,46.58 R8.1 | 28.26,5.89 28.26,7.41 U$2.2
  Bottom 0.152: SDIO_BOT.4 27.65,15.34 27.65,15.79 26.89,16.56 v24.3,16.56 23.84,16.1 v23.84,8.48 | v8.91,42.62 8.91,39.57 13.48,35 23.99,35 26.28,37.28 JP2.3 | v33.29,28.75 35.88,31.34 35.88,37.74 37.1,38.96 J1.VCC3V3@1
N$47  (via drill 0.33)
  Top 0.152: v7.84,7.72 6.93,6.8 LED3.A | v18.2,2.54 19.12,2.54 20.18,1.47 27.5,1.47 28.72,2.69 R14.1
  Bottom 0.152: v7.84,7.72 12.11,7.72 16.68,3.15 17.59,3.15 v18.2,2.54
N$48
  Top 0.152: LED4.A 11.19,6.65 11.65,6.65 15.15,3.15 18.96,3.15 20.34,1.77 25.06,1.77 25.98,2.69 R15.1
N$49
  Top 0.152: LED5.A 15.15,6.65 15.76,6.65 16.83,5.58 18.36,5.58 21.1,2.84 R16.1
N$50  (via drill 0.33)
  Top 0.152: v29.63,20.82 23.54,14.73 20.18,14.73 R19.1
  Bottom 0.152: v29.63,20.82 30.09,20.82 37.1,27.83 38.47,27.83 39.39,28.75 J1.XIO-P5
N$51
  Top 0.152: R18.1 25.82,15.19 27.04,15.19 32.99,21.13 33.6,21.13 35.88,23.41 35.88,25.4 36.8,26.31 J1.XIO-P6
N$52
  Top 0.152: J1.XIO-P7 38.32,26.31 36.19,24.18 36.19,23.26 32.83,19.91 32.83,19.15 R17.1
N$53
  Bottom 0.152: R4.1 19.12,41.24 22.17,41.24 23.08,40.33 27.96,40.33 28.41,40.79 28.41,42.16 X1.2
N$54
  Bottom 0.152: J1.TWI1-SCK 1.74,36.37 2.66,36.37 4.18,34.84 4.64,34.84 5.86,33.62 5.86,33.02 6.01,32.86 8.14,32.86 9.97,34.69 25.21,34.69 25.98,35.45 27.04,35.45 28.87,37.28 JP2.2
N$55
  Bottom 0.152: J1.TWI1-SDA 1.29,38.96 1.29,37.43 0.68,36.83 0.68,36.06 4.18,32.56 9.06,32.56 9.36,32.86 23.84,32.86 26.13,35.15 29.33,35.15 31.46,37.28 JP2.1
N$56
  Top 0.152: Q3.1 26.43,11.07 26.43,11.38 25.82,11.98 R18.2
N$57
  Top 0.152: Q2.1 21.86,11.07 20.64,11.07 20.18,11.53 R19.2
N$58
  Top 0.152: U$2.3 30.24,8.33 35.12,3.45 LED6.A
N$59
  Top 0.152: LED6.C 34.97,1.47 33.44,1.47 33.14,1.77 R20.2
VOUT  (via drill 0.33)
  Top 0.152: v26.89,42.92 27.65,42.16 27.65,41.7 C11.+ 27.8,41.55 28.72,41.55 29.63,40.64 37.41,40.64 37.86,41.09 37.86,42.01 36.19,43.68 32.22,43.68 31.77,44.14 26.74,44.14 21.86,49.02 R6.1 21.71,49.02 19.73,49.02 R5.1 19.58,48.87 18.66,47.95 5.4,47.95 4.18,49.17 J1.CHG-IN
  Bottom 0.152: v26.89,42.92 27.65,42.16 X1.1 | C9.1 8.45,47.95 6.93,46.43 U$1.16 6.77,46.43 5.1,46.43 4.33,45.66 3.57,45.66 2.96,46.27 2.96,48.1 4.03,49.17 J1.CHG-IN

### Text on the board
Top: Multi-DIP
tNames: JKW / v0.8 / 2016